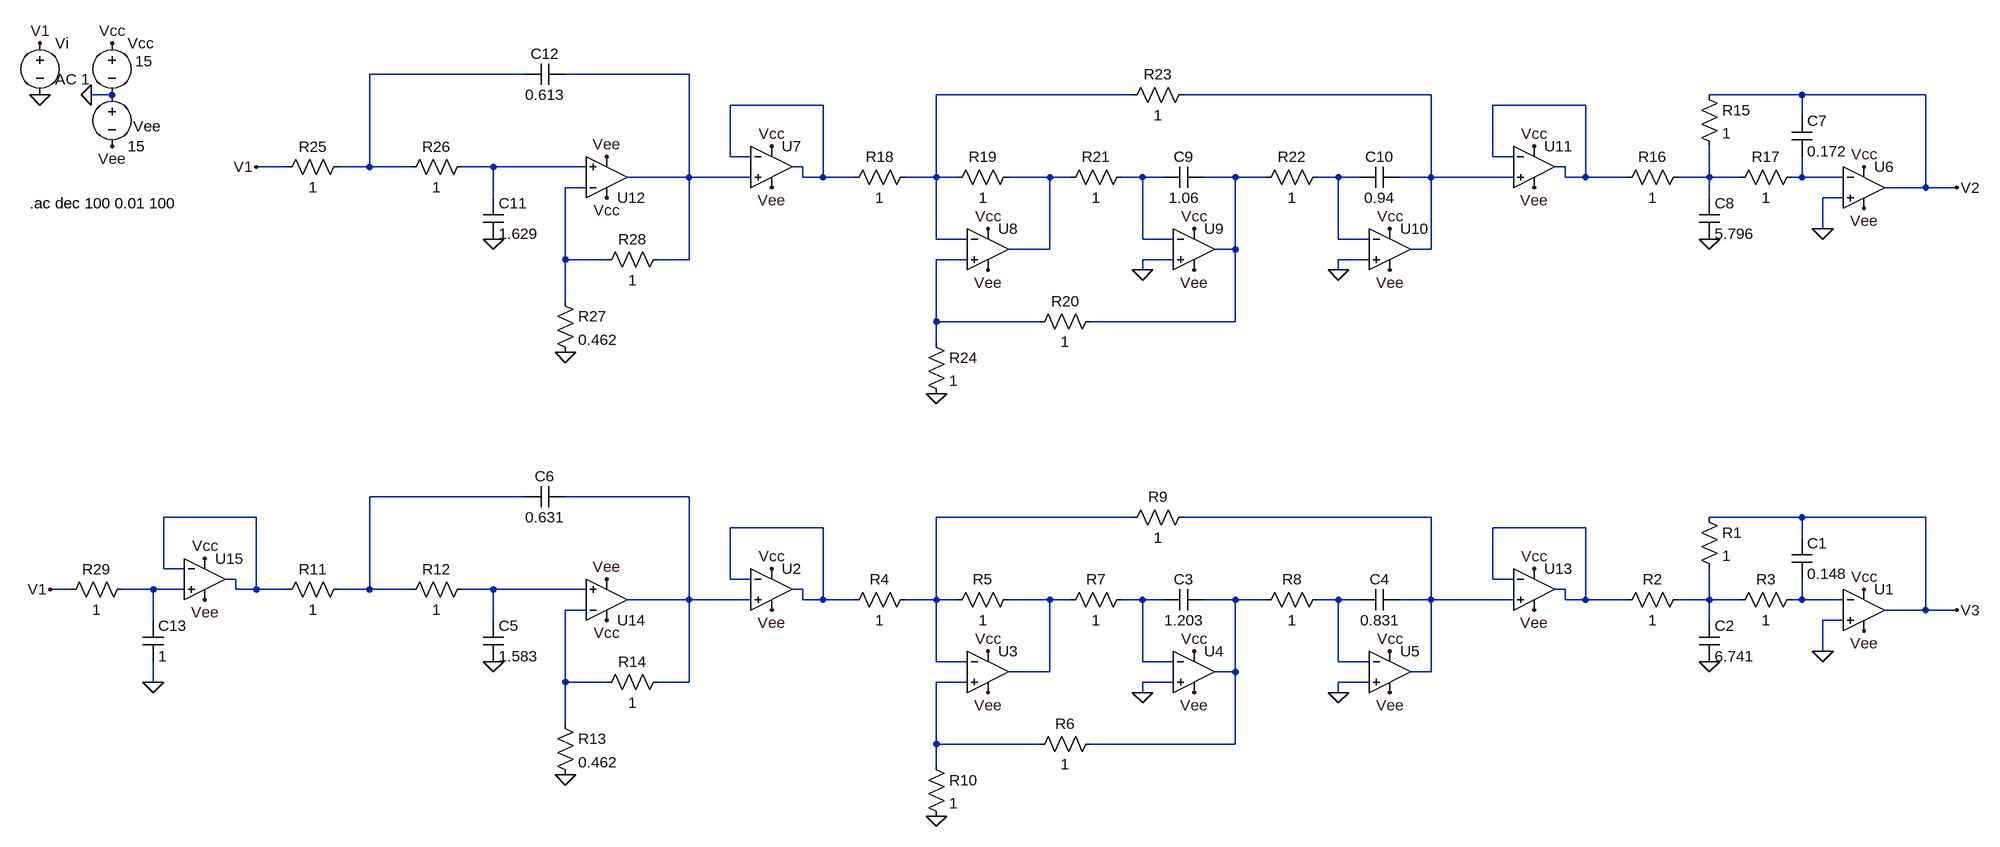
[diagram p0: schematic filtro_butter_orden_6.asc]
filtro_butter_orden_6.asc, the LTspice schematic file:
Version 4.1
SHEET 1 1376 680
WIRE -1184 -592 -1424 -592
WIRE -928 -592 -1120 -592
WIRE -1824 -560 -1856 -560
WIRE -240 -560 -544 -560
WIRE 224 -560 -160 -560
WIRE 800 -560 656 -560
WIRE 992 -560 800 -560
WIRE -720 -544 -864 -544
WIRE 464 -544 320 -544
WIRE 800 -528 800 -560
WIRE -864 -464 -864 -544
WIRE -832 -464 -864 -464
WIRE 320 -464 320 -544
WIRE 352 -464 320 -464
WIRE -1552 -448 -1600 -448
WIRE -1424 -448 -1424 -592
WIRE -1424 -448 -1472 -448
WIRE -1360 -448 -1424 -448
WIRE -1232 -448 -1280 -448
WIRE -1088 -448 -1232 -448
WIRE -752 -448 -768 -448
WIRE 432 -448 416 -448
WIRE -928 -432 -928 -592
WIRE -928 -432 -1024 -432
WIRE -832 -432 -928 -432
WIRE -752 -432 -752 -448
WIRE -720 -432 -720 -544
WIRE -720 -432 -752 -432
WIRE -672 -432 -720 -432
WIRE -544 -432 -544 -560
WIRE -544 -432 -592 -432
WIRE -512 -432 -544 -432
WIRE -368 -432 -432 -432
WIRE -336 -432 -368 -432
WIRE -224 -432 -256 -432
WIRE -192 -432 -224 -432
WIRE -80 -432 -128 -432
WIRE -32 -432 -80 -432
WIRE 80 -432 48 -432
WIRE 112 -432 80 -432
WIRE 224 -432 224 -560
WIRE 224 -432 176 -432
WIRE 352 -432 224 -432
WIRE 432 -432 432 -448
WIRE 464 -432 464 -544
WIRE 464 -432 432 -432
WIRE 528 -432 464 -432
WIRE 656 -432 656 -480
WIRE 656 -432 608 -432
WIRE 704 -432 656 -432
WIRE 800 -432 800 -464
WIRE 800 -432 784 -432
WIRE 864 -432 800 -432
WIRE -1088 -416 -1120 -416
WIRE 992 -416 992 -560
WIRE 992 -416 928 -416
WIRE 1040 -416 992 -416
WIRE -1232 -400 -1232 -448
WIRE 656 -400 656 -432
WIRE 864 -400 832 -400
WIRE 832 -352 832 -400
WIRE -544 -336 -544 -432
WIRE -496 -336 -544 -336
WIRE -224 -336 -224 -432
WIRE -176 -336 -224 -336
WIRE 80 -336 80 -432
WIRE 128 -336 80 -336
WIRE -368 -320 -368 -432
WIRE -368 -320 -432 -320
WIRE -80 -320 -80 -432
WIRE -80 -320 -112 -320
WIRE 224 -320 224 -432
WIRE 224 -320 192 -320
WIRE -1120 -304 -1120 -416
WIRE -1056 -304 -1120 -304
WIRE -928 -304 -928 -432
WIRE -928 -304 -976 -304
WIRE -496 -304 -544 -304
WIRE -176 -304 -224 -304
WIRE 128 -304 80 -304
WIRE -224 -288 -224 -304
WIRE 80 -288 80 -304
WIRE -1120 -240 -1120 -304
WIRE -544 -208 -544 -304
WIRE -384 -208 -544 -208
WIRE -80 -208 -80 -320
WIRE -80 -208 -304 -208
WIRE -544 -176 -544 -208
WIRE -1184 64 -1424 64
WIRE -928 64 -1120 64
WIRE -1600 96 -1744 96
WIRE -240 96 -544 96
WIRE 224 96 -160 96
WIRE 800 96 656 96
WIRE 992 96 800 96
WIRE -720 112 -864 112
WIRE 464 112 320 112
WIRE 800 128 800 96
WIRE -1744 176 -1744 96
WIRE -1712 176 -1744 176
WIRE -1632 192 -1648 192
WIRE -864 192 -864 112
WIRE -832 192 -864 192
WIRE 320 192 320 112
WIRE 352 192 320 192
WIRE -1888 208 -1920 208
WIRE -1760 208 -1808 208
WIRE -1712 208 -1760 208
WIRE -1632 208 -1632 192
WIRE -1600 208 -1600 96
WIRE -1600 208 -1632 208
WIRE -1552 208 -1600 208
WIRE -1424 208 -1424 64
WIRE -1424 208 -1472 208
WIRE -1360 208 -1424 208
WIRE -1232 208 -1280 208
WIRE -1088 208 -1232 208
WIRE -752 208 -768 208
WIRE 432 208 416 208
WIRE -928 224 -928 64
WIRE -928 224 -1024 224
WIRE -832 224 -928 224
WIRE -752 224 -752 208
WIRE -720 224 -720 112
WIRE -720 224 -752 224
WIRE -672 224 -720 224
WIRE -544 224 -544 96
WIRE -544 224 -592 224
WIRE -512 224 -544 224
WIRE -368 224 -432 224
WIRE -336 224 -368 224
WIRE -224 224 -256 224
WIRE -192 224 -224 224
WIRE -80 224 -128 224
WIRE -32 224 -80 224
WIRE 80 224 48 224
WIRE 112 224 80 224
WIRE 224 224 224 96
WIRE 224 224 176 224
WIRE 352 224 224 224
WIRE 432 224 432 208
WIRE 464 224 464 112
WIRE 464 224 432 224
WIRE 528 224 464 224
WIRE 656 224 656 176
WIRE 656 224 608 224
WIRE 704 224 656 224
WIRE 800 224 800 192
WIRE 800 224 784 224
WIRE 864 224 800 224
WIRE -1088 240 -1120 240
WIRE 992 240 992 96
WIRE 992 240 928 240
WIRE 1040 240 992 240
WIRE -1760 256 -1760 208
WIRE -1232 256 -1232 208
WIRE 656 256 656 224
WIRE 864 256 832 256
WIRE 832 304 832 256
WIRE -544 320 -544 224
WIRE -496 320 -544 320
WIRE -224 320 -224 224
WIRE -176 320 -224 320
WIRE 80 320 80 224
WIRE 128 320 80 320
WIRE -368 336 -368 224
WIRE -368 336 -432 336
WIRE -80 336 -80 224
WIRE -80 336 -112 336
WIRE 224 336 224 224
WIRE 224 336 192 336
WIRE -1760 352 -1760 320
WIRE -1120 352 -1120 240
WIRE -1056 352 -1120 352
WIRE -928 352 -928 224
WIRE -928 352 -976 352
WIRE -496 352 -544 352
WIRE -176 352 -224 352
WIRE 128 352 80 352
WIRE -224 368 -224 352
WIRE 80 368 80 352
WIRE -1120 416 -1120 352
WIRE -544 448 -544 352
WIRE -384 448 -544 448
WIRE -80 448 -80 336
WIRE -80 448 -304 448
WIRE -544 480 -544 448
FLAG -1936 -640 V1
FLAG -1936 -560 0
FLAG -1856 -560 0
FLAG -1824 -480 Vee
FLAG -1824 -640 Vcc
FLAG 896 -448 Vcc
FLAG 896 -384 Vee
FLAG 832 -352 0
FLAG 656 -336 0
FLAG -800 -480 Vcc
FLAG -800 -416 Vee
FLAG -464 -352 Vcc
FLAG -464 -288 Vee
FLAG -144 -352 Vcc
FLAG -144 -288 Vee
FLAG -224 -288 0
FLAG 160 -352 Vcc
FLAG 160 -288 Vee
FLAG 80 -288 0
FLAG -544 -96 0
FLAG 384 -480 Vcc
FLAG 384 -416 Vee
FLAG -1232 -336 0
FLAG -1056 -400 Vcc
FLAG -1056 -464 Vee
FLAG -1120 -160 0
FLAG 1040 -416 V2
FLAG -1600 -448 V1
FLAG 896 208 Vcc
FLAG 896 272 Vee
FLAG 832 304 0
FLAG 656 320 0
FLAG -800 176 Vcc
FLAG -800 240 Vee
FLAG -464 304 Vcc
FLAG -464 368 Vee
FLAG -144 304 Vcc
FLAG -144 368 Vee
FLAG -224 368 0
FLAG 160 304 Vcc
FLAG 160 368 Vee
FLAG 80 368 0
FLAG -544 560 0
FLAG 384 176 Vcc
FLAG 384 240 Vee
FLAG -1232 320 0
FLAG -1056 256 Vcc
FLAG -1056 192 Vee
FLAG -1120 496 0
FLAG 1040 240 V3
FLAG -1680 160 Vcc
FLAG -1680 224 Vee
FLAG -1760 352 0
FLAG -1920 208 V1
SYMBOL voltage -1936 -656 R0
WINDOW 3 24 44 Left 2
WINDOW 123 24 72 Left 2
WINDOW 39 0 0 Left 0
SYMATTR Value ""
SYMATTR Value2 AC 1
SYMATTR InstName Vi
SYMBOL voltage -1824 -656 R0
WINDOW 3 36 44 Left 2
WINDOW 123 0 0 Left 0
WINDOW 39 0 0 Left 0
SYMATTR Value 15
SYMATTR InstName Vcc
SYMBOL voltage -1824 -576 R0
WINDOW 0 33 65 Left 2
WINDOW 123 0 0 Left 0
WINDOW 39 0 0 Left 0
SYMATTR InstName Vee
SYMATTR Value 15
SYMBOL OpAmps\\UniversalOpAmp1 896 -416 R0
SYMATTR InstName U6
SYMBOL cap 784 -528 R0
SYMATTR InstName C7
SYMATTR Value 0.172
SYMBOL res 640 -576 R0
SYMATTR InstName R15
SYMATTR Value 1
SYMBOL res 624 -448 R90
WINDOW 0 0 56 VBottom 2
WINDOW 3 32 56 VTop 2
SYMATTR InstName R16
SYMATTR Value 1
SYMBOL res 800 -448 R90
WINDOW 0 0 56 VBottom 2
WINDOW 3 32 56 VTop 2
SYMATTR InstName R17
SYMATTR Value 1
SYMBOL cap 640 -400 R0
SYMATTR InstName C8
SYMATTR Value 5.796
SYMBOL OpAmps\\UniversalOpAmp1 -800 -448 R0
SYMATTR InstName U7
SYMBOL res -576 -448 R90
WINDOW 0 0 56 VBottom 2
WINDOW 3 32 56 VTop 2
SYMATTR InstName R18
SYMATTR Value 1
SYMBOL res -416 -448 R90
WINDOW 0 0 56 VBottom 2
WINDOW 3 32 56 VTop 2
SYMATTR InstName R19
SYMATTR Value 1
SYMBOL OpAmps\\UniversalOpAmp1 -464 -320 R0
SYMATTR InstName U8
SYMBOL res -288 -224 R90
WINDOW 0 0 56 VBottom 2
WINDOW 3 32 56 VTop 2
SYMATTR InstName R20
SYMATTR Value 1
SYMBOL res -240 -448 R90
WINDOW 0 0 56 VBottom 2
WINDOW 3 32 56 VTop 2
SYMATTR InstName R21
SYMATTR Value 1
SYMBOL OpAmps\\UniversalOpAmp1 -144 -320 R0
SYMATTR InstName U9
SYMBOL cap -128 -448 R90
WINDOW 0 0 32 VBottom 2
WINDOW 3 32 32 VTop 2
SYMATTR InstName C9
SYMATTR Value 1.06
SYMBOL res 64 -448 R90
WINDOW 0 0 56 VBottom 2
WINDOW 3 32 56 VTop 2
SYMATTR InstName R22
SYMATTR Value 1
SYMBOL OpAmps\\UniversalOpAmp1 160 -320 R0
SYMATTR InstName U10
SYMBOL cap 176 -448 R90
WINDOW 0 0 32 VBottom 2
WINDOW 3 32 32 VTop 2
SYMATTR InstName C10
SYMATTR Value 0.94
SYMBOL res -144 -576 R90
WINDOW 0 0 56 VBottom 2
WINDOW 3 32 56 VTop 2
SYMATTR InstName R23
SYMATTR Value 1
SYMBOL res -560 -192 R0
SYMATTR InstName R24
SYMATTR Value 1
SYMBOL OpAmps\\UniversalOpAmp1 384 -448 R0
SYMATTR InstName U11
SYMBOL res -1456 -464 R90
WINDOW 0 0 56 VBottom 2
WINDOW 3 32 56 VTop 2
SYMATTR InstName R25
SYMATTR Value 1
SYMBOL res -1264 -464 R90
WINDOW 0 0 56 VBottom 2
WINDOW 3 32 56 VTop 2
SYMATTR InstName R26
SYMATTR Value 1
SYMBOL cap -1248 -400 R0
SYMATTR InstName C11
SYMATTR Value 1.629
SYMBOL OpAmps\\UniversalOpAmp1 -1056 -432 M180
SYMATTR InstName U12
SYMBOL res -1136 -256 R0
SYMATTR InstName R27
SYMATTR Value 0.462
SYMBOL cap -1120 -608 R90
WINDOW 0 0 32 VBottom 2
WINDOW 3 32 32 VTop 2
SYMATTR InstName C12
SYMATTR Value 0.613
SYMBOL res -960 -320 R90
WINDOW 0 0 56 VBottom 2
WINDOW 3 32 56 VTop 2
SYMATTR InstName R28
SYMATTR Value 1
SYMBOL OpAmps\\UniversalOpAmp1 896 240 R0
SYMATTR InstName U1
SYMBOL cap 784 128 R0
SYMATTR InstName C1
SYMATTR Value 0.148
SYMBOL res 640 80 R0
SYMATTR InstName R1
SYMATTR Value 1
SYMBOL res 624 208 R90
WINDOW 0 0 56 VBottom 2
WINDOW 3 32 56 VTop 2
SYMATTR InstName R2
SYMATTR Value 1
SYMBOL res 800 208 R90
WINDOW 0 0 56 VBottom 2
WINDOW 3 32 56 VTop 2
SYMATTR InstName R3
SYMATTR Value 1
SYMBOL cap 640 256 R0
SYMATTR InstName C2
SYMATTR Value 6.741
SYMBOL OpAmps\\UniversalOpAmp1 -800 208 R0
SYMATTR InstName U2
SYMBOL res -576 208 R90
WINDOW 0 0 56 VBottom 2
WINDOW 3 32 56 VTop 2
SYMATTR InstName R4
SYMATTR Value 1
SYMBOL res -416 208 R90
WINDOW 0 0 56 VBottom 2
WINDOW 3 32 56 VTop 2
SYMATTR InstName R5
SYMATTR Value 1
SYMBOL OpAmps\\UniversalOpAmp1 -464 336 R0
SYMATTR InstName U3
SYMBOL res -288 432 R90
WINDOW 0 0 56 VBottom 2
WINDOW 3 32 56 VTop 2
SYMATTR InstName R6
SYMATTR Value 1
SYMBOL res -240 208 R90
WINDOW 0 0 56 VBottom 2
WINDOW 3 32 56 VTop 2
SYMATTR InstName R7
SYMATTR Value 1
SYMBOL OpAmps\\UniversalOpAmp1 -144 336 R0
SYMATTR InstName U4
SYMBOL cap -128 208 R90
WINDOW 0 0 32 VBottom 2
WINDOW 3 32 32 VTop 2
SYMATTR InstName C3
SYMATTR Value 1.203
SYMBOL res 64 208 R90
WINDOW 0 0 56 VBottom 2
WINDOW 3 32 56 VTop 2
SYMATTR InstName R8
SYMATTR Value 1
SYMBOL OpAmps\\UniversalOpAmp1 160 336 R0
SYMATTR InstName U5
SYMBOL cap 176 208 R90
WINDOW 0 0 32 VBottom 2
WINDOW 3 32 32 VTop 2
SYMATTR InstName C4
SYMATTR Value 0.831
SYMBOL res -144 80 R90
WINDOW 0 0 56 VBottom 2
WINDOW 3 32 56 VTop 2
SYMATTR InstName R9
SYMATTR Value 1
SYMBOL res -560 464 R0
SYMATTR InstName R10
SYMATTR Value 1
SYMBOL OpAmps\\UniversalOpAmp1 384 208 R0
SYMATTR InstName U13
SYMBOL res -1456 192 R90
WINDOW 0 0 56 VBottom 2
WINDOW 3 32 56 VTop 2
SYMATTR InstName R11
SYMATTR Value 1
SYMBOL res -1264 192 R90
WINDOW 0 0 56 VBottom 2
WINDOW 3 32 56 VTop 2
SYMATTR InstName R12
SYMATTR Value 1
SYMBOL cap -1248 256 R0
SYMATTR InstName C5
SYMATTR Value 1.583
SYMBOL OpAmps\\UniversalOpAmp1 -1056 224 M180
SYMATTR InstName U14
SYMBOL res -1136 400 R0
SYMATTR InstName R13
SYMATTR Value 0.462
SYMBOL cap -1120 48 R90
WINDOW 0 0 32 VBottom 2
WINDOW 3 32 32 VTop 2
SYMATTR InstName C6
SYMATTR Value 0.631
SYMBOL res -960 336 R90
WINDOW 0 0 56 VBottom 2
WINDOW 3 32 56 VTop 2
SYMATTR InstName R14
SYMATTR Value 1
SYMBOL OpAmps\\UniversalOpAmp1 -1680 192 R0
SYMATTR InstName U15
SYMBOL cap -1776 256 R0
SYMATTR InstName C13
SYMATTR Value 1
SYMBOL res -1792 192 R90
WINDOW 0 0 56 VBottom 2
WINDOW 3 32 56 VTop 2
SYMATTR InstName R29
SYMATTR Value 1
TEXT -1952 -392 Left 2 !.ac dec 100 0.01 100

The netlist it stands for:
* filtro_butter_orden_6.asc
Vi V1 0 AC 1
Vcc Vcc 0 15
Vee 0 Vee 15
X§U6 0 N013 Vcc Vee V2 level1 Avol=1Meg GBW=10Meg Vos=0 En=0 Enk=0 In=0 Ink=0 Rin=500Meg  ; pins In+ In- V+ V- OUT
C7 V2 N013 0.172
R15 V2 N012 1
R16 N012 N006 1
R17 N013 N012 1
C8 N012 0 5.796
X§U7 N002 N005 Vcc Vee N005 level1 Avol=1Meg GBW=10Meg Vos=0 En=0 Enk=0 In=0 Ink=0 Rin=500Meg  ; pins In+ In- V+ V- OUT
R18 N003 N005 1
R19 N008 N003 1
X§U8 N015 N003 Vcc Vee N008 level1 Avol=1Meg GBW=10Meg Vos=0 En=0 Enk=0 In=0 Ink=0 Rin=500Meg  ; pins In+ In- V+ V- OUT
R20 N010 N015 1
R21 N009 N008 1
X§U9 0 N009 Vcc Vee N010 level1 Avol=1Meg GBW=10Meg Vos=0 En=0 Enk=0 In=0 Ink=0 Rin=500Meg  ; pins In+ In- V+ V- OUT
C9 N010 N009 1.06
R22 N011 N010 1
X§U10 0 N011 Vcc Vee N004 level1 Avol=1Meg GBW=10Meg Vos=0 En=0 Enk=0 In=0 Ink=0 Rin=500Meg  ; pins In+ In- V+ V- OUT
C10 N004 N011 0.94
R23 N004 N003 1
R24 N015 0 1
X§U11 N004 N006 Vcc Vee N006 level1 Avol=1Meg GBW=10Meg Vos=0 En=0 Enk=0 In=0 Ink=0 Rin=500Meg  ; pins In+ In- V+ V- OUT
R25 N001 V1 1
R26 N007 N001 1
C11 N007 0 1.629
X§U12 N007 N014 Vcc Vee N002 level1 Avol=1Meg GBW=10Meg Vos=0 En=0 Enk=0 In=0 Ink=0 Rin=500Meg  ; pins In+ In- V+ V- OUT
R27 N014 0 0.462
C12 N002 N001 0.613
R28 N002 N014 1
X§U1 0 N030 Vcc Vee V3 level1 Avol=1Meg GBW=10Meg Vos=0 En=0 Enk=0 In=0 Ink=0 Rin=500Meg  ; pins In+ In- V+ V- OUT
C1 V3 N030 0.148
R1 V3 N029 1
R2 N029 N022 1
R3 N030 N029 1
C2 N029 0 6.741
X§U2 N017 N021 Vcc Vee N021 level1 Avol=1Meg GBW=10Meg Vos=0 En=0 Enk=0 In=0 Ink=0 Rin=500Meg  ; pins In+ In- V+ V- OUT
R4 N019 N021 1
R5 N025 N019 1
X§U3 N032 N019 Vcc Vee N025 level1 Avol=1Meg GBW=10Meg Vos=0 En=0 Enk=0 In=0 Ink=0 Rin=500Meg  ; pins In+ In- V+ V- OUT
R6 N027 N032 1
R7 N026 N025 1
X§U4 0 N026 Vcc Vee N027 level1 Avol=1Meg GBW=10Meg Vos=0 En=0 Enk=0 In=0 Ink=0 Rin=500Meg  ; pins In+ In- V+ V- OUT
C3 N027 N026 1.203
R8 N028 N027 1
X§U5 0 N028 Vcc Vee N020 level1 Avol=1Meg GBW=10Meg Vos=0 En=0 Enk=0 In=0 Ink=0 Rin=500Meg  ; pins In+ In- V+ V- OUT
C4 N020 N028 0.831
R9 N020 N019 1
R10 N032 0 1
X§U13 N020 N022 Vcc Vee N022 level1 Avol=1Meg GBW=10Meg Vos=0 En=0 Enk=0 In=0 Ink=0 Rin=500Meg  ; pins In+ In- V+ V- OUT
R11 N016 N018 1
R12 N024 N016 1
C5 N024 0 1.583
X§U14 N024 N031 Vcc Vee N017 level1 Avol=1Meg GBW=10Meg Vos=0 En=0 Enk=0 In=0 Ink=0 Rin=500Meg  ; pins In+ In- V+ V- OUT
R13 N031 0 0.462
C6 N017 N016 0.631
R14 N017 N031 1
X§U15 N023 N018 Vcc Vee N018 level1 Avol=1Meg GBW=10Meg Vos=0 En=0 Enk=0 In=0 Ink=0 Rin=500Meg  ; pins In+ In- V+ V- OUT
C13 N023 0 1
R29 N023 V1 1
.ac dec 100 0.01 100
.lib UniversalOpAmp1.lib
.backanno
.end